# Altium schematic sheet Car.SchDoc
size 420 x 297 mm; DocumentNumber: 1; SheetNumber: 1; SheetTotal: 2
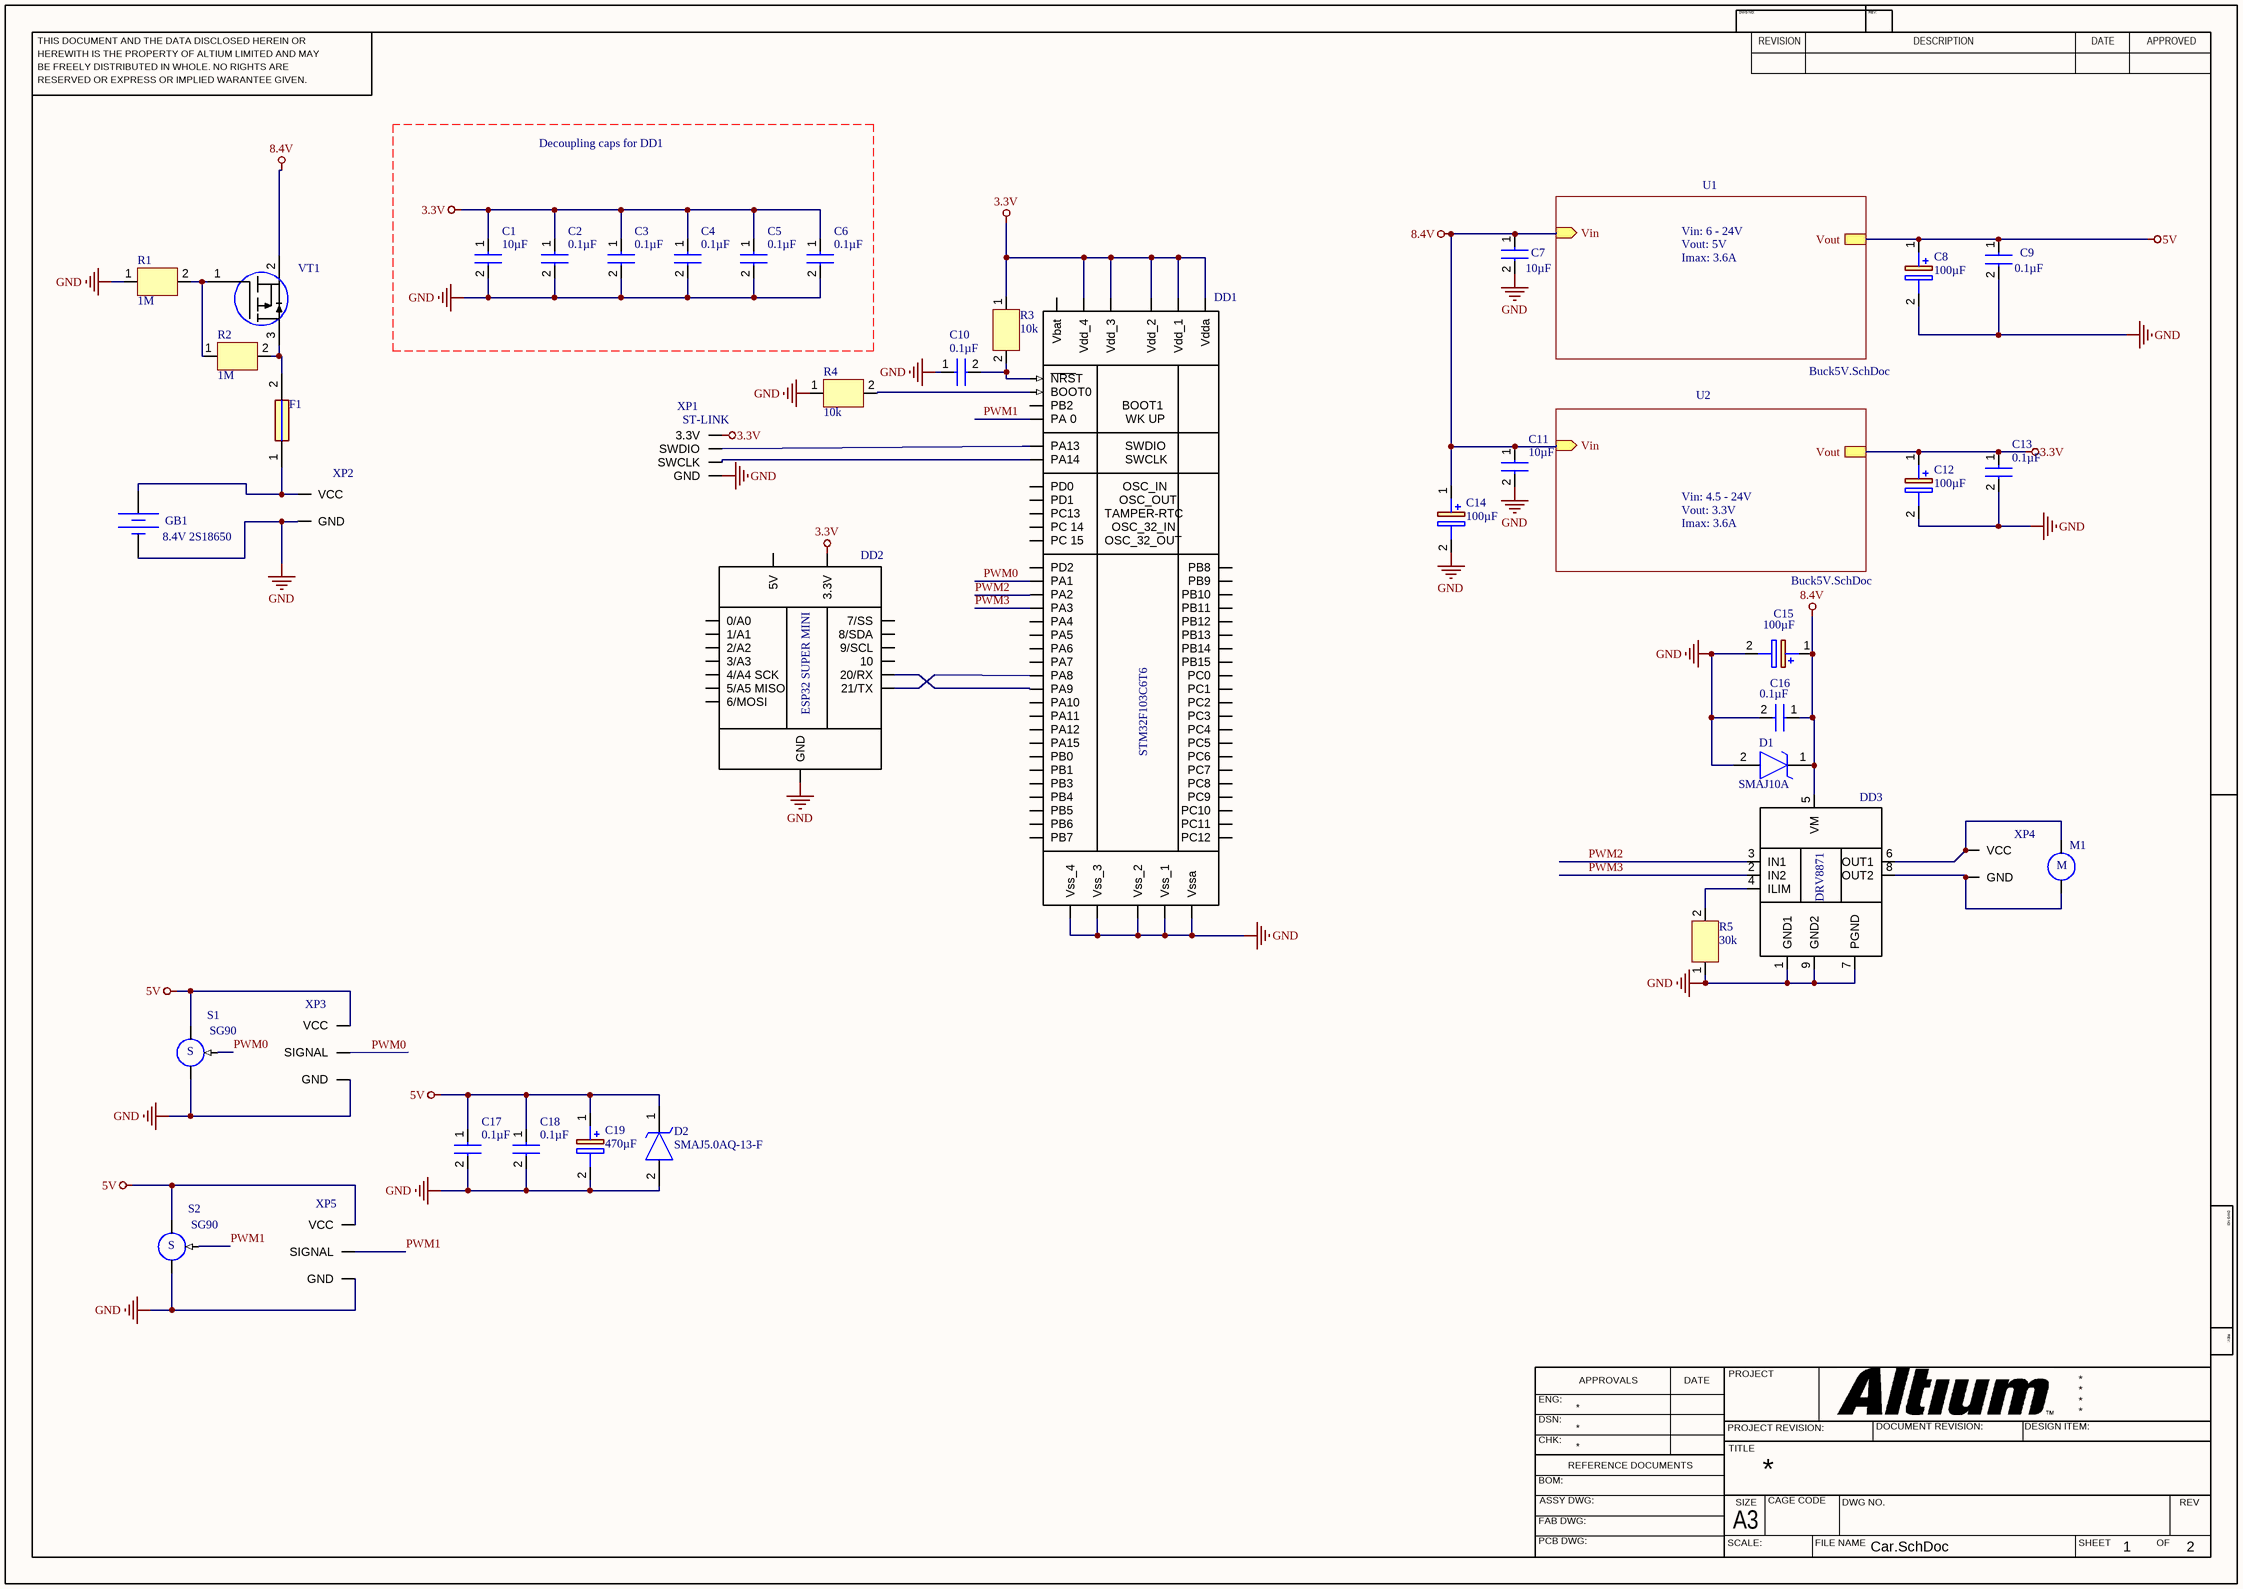
[diagram p0: Car.SchDoc]

## Parts
C1  10µF  [CAPC2012X145N]
C2  0.1µF  [CAPC2012X145N]
C3  0.1µF  [CAPC2012X145N]
C4  0.1µF  [CAPC2012X145N]
C5  0.1µF  [CAPC2012X145N]
C6  0.1µF  [CAPC2012X145N]
C7  10µF  [CAPC2012X145N]
C8  100µF  [T491C]
C9  0.1µF  [CAPC2012X145N]
C10  0.1µF  [CAPC2012X145N]
C11  10µF  [CAPC2012X145N]
C12  100µF  [T491C]
C13  0.1µF  [CAPC2012X145N]
C14  100µF  [T491C]
C15  100µF  [EEE0JA331XP]
C16  0.1µF  [CAPC2012X145N]
C17  0.1µF  [CAPC2012X145N]
C18  0.1µF  [CAPC2012X145N]
C19  470µF  [EEEFK1V331P]
D1  SMAJ10A  [SODFL5226X240N]
D2  SMAJ5.0AQ-13-F  [SODFL5226X240N]
DD1  (no value)  [STM32F103C6T6]
DD2  (no value)  [ESP32C3_SUPER_MINI]
DD3  (no value)  [DRV8871DDA]
F1  Schurter  USI 8053370874 I = 4A, U = 32V  [FUSC3116X70N]  (value not drawn)
GB1  DC Magnitude: 8.4V 2S18650  (hidden comment: Constant Voltage Source)
M1  (no value)
R1  1M  [CAPC2012X145N]
R2  1M  [CAPC2012X145N]
R3  10k  [CAPC2012X145N]
R4  10k  [CAPC2012X145N]
R5  30k  [CAPC2012X145N]
S1  SG90
S2  SG90
VT1  IRLML6401  [SOT95P237X112-3N]  (value not drawn)
XP1  ST-LINK  [ST-LINK]
XP2  (no value)  [EXT_SENSOR]
XP3  (no value)  [EXT_SENSOR_3pin]
XP4  (no value)  [EXT_SENSOR]
XP5  (no value)  [EXT_SENSOR_3pin]

## Sub-sheets
U1 = Buck5V.SchDoc: Vin (in), Vout  | R2: 7.5k; R4: 75k; R9: 20k
U2 = Buck5V.SchDoc: Vin (in), Vout  | R2: 12.7k; R4: 64.9k; R9: 33k

## Nets
3.3V: C1.1 C2.1 C3.1 C4.1 C5.1 C6.1 C12.1(+) C13.1 DD1.13(Vdda) DD1.19(Vdd_4) DD1.32(Vdd_1) DD1.48(Vdd_2) DD1.64(Vdd_3) DD2.3.3V R3.1 XP1.3.3V ; sheet U2/Vout
5V: C8.1(+) C9.1 C17.1 C18.1 C19.1(+) D2.1(K) S1.1 S2.1 XP3.1(VCC) XP5.1(VCC) ; sheet U1/Vout
8.4V: C7.1 C11.1 C14.1(+) C15.1(+) C16.1 D1.1(K) DD3.5(VM) VT1.2(S) ; sheet U1/Vin, sheet U2/Vin
GND: C1.2 C2.2 C3.2 C4.2 C5.2 C6.2 C7.2 C8.2(-) C9.2 C10.1 C11.2 C12.2(-) C13.2 C14.2(-) C15.2(-) C16.2 C17.2 C18.2 C19.2(-) D1.2(A) D2.2(A) DD1.12(Vssa) DD1.18(Vss_4) DD1.31(Vss_1) DD1.47(Vss_2) DD1.63(Vss_3) DD2.GND DD3.1(GND1) DD3.7(PGND) DD3.9(GND2) GB1.2 R1.1 R4.1 R5.1 S1.2 S2.2 XP1.GND XP2.2(GND) XP3.3(GND) XP5.3(GND)
PWM0: DD1.15(PA1) S1.3 XP3.2(SIGNAL)
PWM1: DD1.14(PA_0______________WK_UP) S2.3 XP5.2(SIGNAL)
PWM2: DD1.16(PA2) DD3.3(IN1)
PWM3: DD1.17(PA3) DD3.2(IN2)
NetC10_2: C10.2 DD1.7(~{NRS}T) R3.2
NetDD1_41: DD1.41(PA8) DD2.GPIO21(21/TX)
NetDD1_42: DD1.42(PA9) DD2.GPIO20(20/RX)
NetDD1_46: DD1.46(PA13_____________SWDIO) XP1.SWDIO
NetDD1_49: DD1.49(PA14_____________SWCLK) XP1.SWCLK
NetDD1_60: DD1.60(BOOT0) R4.2
NetDD3_4: DD3.4(ILIM) R5.2
NetDD3_6: DD3.6(OUT1) M1.1 XP4.1(VCC)
NetDD3_8: DD3.8(OUT2) M1.2 XP4.2(GND)
NetF1_1: F1.1 GB1.1 XP2.1(VCC)
NetF1_2: F1.2 R2.2 VT1.3(D)
NetR1_2: R1.2 R2.1 VT1.1(G)

Not connected (* = marked no-connect by the designer): DD1 1(Vbat) 2(PC13_______TAMPER-RTC) 3(PC_14________OSC_32_IN) 4(PC_15______OSC_32_OUT) 5(PD0______________OSC_IN) 6(PD1_____________OSC_OUT) 8(PC0) 9(PC1) 10(PC2) 11(PC3) 20(PA4) 21(PA5) 22(PA6) 23(PA7) 24(PC4) 25(PC5) 26(PB0) 27(PB1) 28(PB2______________BOOT1) 29(PB10) 30(PB11) 33(PB12) 34(PB13) 35(PB14) 36(PB15) 37(PC6) 38(PC7) 39(PC8) 40(PC9) 43(PA10) 44(PA11) 45(PA12) 50(PA15) 51(PC10) 52(PC11) 53(PC12) 54(PD2) 55(PB3) 56(PB4) 57(PB5) 58(PB6) 59(PB7) 61(PB8) 62(PB9); DD2 5V GPIO0(0/A0) GPIO1(1/A1) GPIO2(2/A2) GPIO3(3/A3) GPIO4(4/A4_SCK) GPIO5(5/A5_MISO) GPIO6(6/MOSI) GPIO7(7/SS) GPIO8(8/SDA) GPIO9(9/SCL) GPIO10(10)

## Notes on the sheet
- Decoupling caps for DD1
- Vin: 6 - 24V
- Vout: 5V
- Imax: 3.6A
- Vin: 4.5 - 24V
- Vout: 3.3V
- THIS DOCUMENT AND THE DATA DISCLOSED HEREIN OR
- HEREWITH IS THE PROPERTY OF ALTIUM LIMITED AND MAY
- DWG NO:
- REVISION
- REV:
- DESCRIPTION
- DATE
- APPROVED
- BE FREELY DISTRIBUTED IN WHOLE. NO RIGHTS ARE
- RESERVED OR EXPRESS OR IMPLIED WARANTEE GIVEN.
- ENG:
- APPROVALS
- PROJECT
- DSN:
- CHK:
- REFERENCE DOCUMENTS
- PROJECT REVISION:
- TITLE
- DOCUMENT REVISION:
- DESIGN ITEM:
- BOM:
- FAB DWG:
- PCB DWG:
- ASSY DWG:
- SCALE:
- A3
- SIZE
- CAGE CODE
- FILE NAME
- DWG NO.
- SHEET
- OF
- REV
- (in symbol DRV8871DDA) DRV8871
- (in symbol ESP32_SUPER_MINI) ESP32 SUPER MINI
- (in symbol Motor) M
- (in symbol Servo) S

## Library data of the parts
C1-C7 C9-C11 C13 C16-C18 = 0805C: Capacitor; Manufacturer_Name: SAMSUNG; Manufacturer_Part_Number: CL21A106KAYNNNE; Datasheet Link: https://datasheet.datasheetarchive.com/originals/distributors/Datasheets_SAMA/6a45835c9b7400e9b49c55c38a8ff4a2.pdf; Height: 1.45mm; Mouser Part Number: 187-CL21A106KAYNNNE; Mouser Price/Stock: https://www.mouser.co.uk/ProductDetail/Samsung-Electro-Mechanics/CL21A106KAYNNNE?qs=yOVawPpwOwmTXAd4dJtNjA%3D%3D; Arrow Part Number: CL21A106KAYNNNE; Arrow Price/Stock: https://www.arrow.com/en/products/cl21a106kaynnne/samsung-electro-mechanics?utm_currency=USD&region=nac
C8 C12 C14 = Capacitor Tantal Case C: Capacitor Polarised; Manufacturer_Name: YAGEO; Manufacturer_Part_Number: T491C107M016AT; Datasheet Link: https://content.kemet.com/datasheets/KEM_T2005_T491.pdf; Height: 2.8mm; Mouser Part Number: 80-T491C107M016AT; Mouser Price/Stock: https://www.mouser.co.uk/ProductDetail/KEMET/T491C107M016AT?qs=W04EqCCJmmuOmj0nZmoJtg%3D%3D
C15 = EEE-FK1E101XP: Capacitor Polarised; Manufacturer_Name: Panasonic; Datasheet Link: http://industrial.panasonic.com/cdbs/www-data/pdf/RDE0000/ABA0000C1181.pdf; Height: 7.8mm; Manufacturer_Part_Number: EEE-FK1E101XP; Mouser Part Number: 667-EEE-FK1E101XP; Mouser Price/Stock: https://www.mouser.co.uk/ProductDetail/Panasonic/EEE-FK1E101XP?qs=qE6bgDGEOCsW6NVslB4juQ%3D%3D; Arrow Part Number: EEE-FK1E101XP; Arrow Price/Stock: https://www.arrow.com/en/products/eee-fk1e101xp/panasonic?region=nac
C19 = EEE-FK1E471P: Capacitor Polarised; Manufacturer_Name: Panasonic; Datasheet Link: http://industrial.panasonic.com/cdbs/www-data/pdf/RDE0000/ABA0000C1181.pdf; Manufacturer_Part_Number: EEE-FK1E471P; Mouser Part Number: 667-EEE-FK1E471P; Mouser Price/Stock: https://www.mouser.co.uk/ProductDetail/Panasonic/EEE-FK1E471P?qs=qE6bgDGEOCvvsolWS4cebg%3D%3D; Arrow Part Number: EEE-FK1E471P; Arrow Price/Stock: https://www.arrow.com/en/products/eee-fk1e471p/panasonic?utm_currency=USD&region=europe
D1 D2 = SMAJ5.0AQ-13-F: TVS Diode (Uni-directional); Manufacturer_Name: Diodes Incorporated; Datasheet Link: https://www.mouser.de/datasheet/2/115/ds40739-1500914.pdf; Height: 2.4mm; Manufacturer_Part_Number: SMAJ5.0AQ-13-F; Mouser Part Number: 621-SMAJ5.0AQ-13-F; Mouser Price/Stock: https://www.mouser.co.uk/ProductDetail/Diodes-Incorporated/SMAJ5.0AQ-13-F?qs=17u8i%2FzlE8%2FlC4rBSQmAww%3D%3D
DD1 = STM32F103C6T6
DD2 = ESP32_SUPER_MINI
DD3 = DRV8871DDA
F1 = SF-1206S500-2: Manufacturer_Name: Bourns; Datasheet Link: https://componentsearchengine.com/Datasheets/2/SF-1206S500-2.pdf; Height: 0.7mm; Manufacturer_Part_Number: SF-1206S500-2; Mouser Part Number: 652-SF-1206S500-2; Mouser Price/Stock: https://www.mouser.co.uk/ProductDetail/Bourns/SF-1206S500-2?qs=GIQXYiEeHGD%252By2V9Xr7ztw%3D%3D; Arrow Part Number: SF-1206S500-2; Arrow Price/Stock: https://www.arrow.com/en/products/sf-1206s500-2/bourns?region=nac
GB1 = Battery: SimulationGenericComponent: True
M1 = Motor
R1-R5 = 0805R: Resistor; Manufacturer_Name: SAMSUNG; Manufacturer_Part_Number: CL21A106KAYNNNE; Datasheet Link: https://datasheet.datasheetarchive.com/originals/distributors/Datasheets_SAMA/6a45835c9b7400e9b49c55c38a8ff4a2.pdf; Height: 1.45mm; Mouser Part Number: 187-CL21A106KAYNNNE; Mouser Price/Stock: https://www.mouser.co.uk/ProductDetail/Samsung-Electro-Mechanics/CL21A106KAYNNNE?qs=yOVawPpwOwmTXAd4dJtNjA%3D%3D; Arrow Part Number: CL21A106KAYNNNE; Arrow Price/Stock: https://www.arrow.com/en/products/cl21a106kaynnne/samsung-electro-mechanics?utm_currency=USD&region=nac
S1 S2 = Servo
VT1 = IRLML6401: Integrated Circuit; Manufacturer_Name: UMW(Youtai Semiconductor Co.; Height: 1.12mm; Manufacturer_Part_Number: IRLML6401
XP2 XP4 = EXT_SENSOR
XP3 XP5 = EXT_SENSOR_3pin